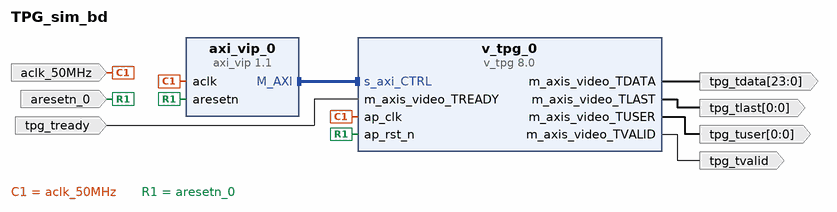
[diagram p0: block diagram of the top level]
# Vivado block design TPG_sim_bd, xc7z020clg484-1, Vivado 2019.1
create_bd_design TPG_sim_bd

create_bd_port -dir I -type clk aclk_50MHz
set_property -dict {CONFIG.FREQ_HZ 50000000} [get_bd_ports aclk_50MHz]
create_bd_port -dir I -type rst aresetn_0
create_bd_port -dir O -from 23 -to 0 tpg_tdata
create_bd_port -dir O -from 0 -to 0 tpg_tlast
create_bd_port -dir I tpg_tready
create_bd_port -dir O -from 0 -to 0 tpg_tuser
create_bd_port -dir O tpg_tvalid

create_bd_cell -type ip -vlnv xilinx.com:ip:axi_vip:1.1 axi_vip_0
set_property -dict [list \
  CONFIG.ADDR_WIDTH 12 \
  CONFIG.DATA_WIDTH 32 \
  CONFIG.HAS_BRESP 1 \
  CONFIG.HAS_PROT 1 \
  CONFIG.HAS_RRESP 1 \
  CONFIG.HAS_WSTRB 1 \
  CONFIG.INTERFACE_MODE MASTER \
  CONFIG.PROTOCOL AXI4LITE \
  CONFIG.READ_WRITE_MODE READ_WRITE \
] [get_bd_cells axi_vip_0]
create_bd_cell -type ip -vlnv xilinx.com:ip:v_tpg:8.0 v_tpg_0

# ---- connections ----

connect_bd_intf_net [get_bd_intf_pins axi_vip_0/M_AXI] [get_bd_intf_pins v_tpg_0/s_axi_CTRL]
connect_bd_net -net aclk_0_1 [get_bd_ports aclk_50MHz] [get_bd_pins axi_vip_0/aclk] [get_bd_pins v_tpg_0/ap_clk]
connect_bd_net -net aresetn_0_1 [get_bd_ports aresetn_0] [get_bd_pins axi_vip_0/aresetn] [get_bd_pins v_tpg_0/ap_rst_n]
connect_bd_net -net tready_1 [get_bd_ports tpg_tready] [get_bd_pins v_tpg_0/m_axis_video_TREADY]
connect_bd_net [get_bd_pins v_tpg_0/m_axis_video_TDATA] [get_bd_ports tpg_tdata]
connect_bd_net [get_bd_pins v_tpg_0/m_axis_video_TLAST] [get_bd_ports tpg_tlast]
connect_bd_net [get_bd_pins v_tpg_0/m_axis_video_TUSER] [get_bd_ports tpg_tuser]
connect_bd_net [get_bd_pins v_tpg_0/m_axis_video_TVALID] [get_bd_ports tpg_tvalid]

# ---- address map ----
assign_bd_address -offset 0x000 -range 4K -target_address_space [get_bd_addr_spaces axi_vip_0/Master_AXI] [get_bd_addr_segs v_tpg_0/s_axi_CTRL/Reg]

validate_bd_design
save_bd_design
